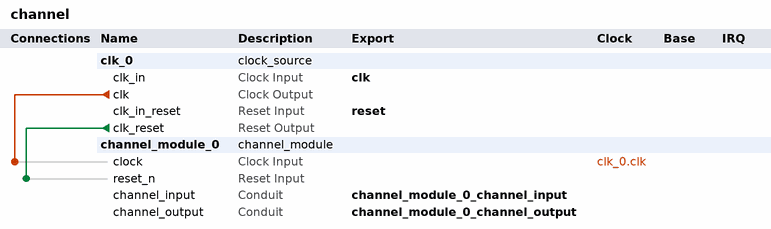
[diagram p0: system contents]
# Platform Designer (Qsys) system channel, Cyclone V 5CSEMA5F31C6
# Parameters at their usual value, and those the tool derives, are not listed.
package require -exact qsys 22.1
create_system channel
set_project_property DEVICE_FAMILY {Cyclone V}
set_project_property DEVICE 5CSEMA5F31C6

add_instance clk_0 clock_source 22.1
set_instance_parameter_value clk_0 clockFrequency 50000000

add_instance channel_module_0 channel_module 1.0
set_instance_parameter_value channel_module_0 PULSE_RESPONSE_LENGTH 2
set_instance_parameter_value channel_module_0 SIGNAL_RESOLUTION 8
set_instance_parameter_value channel_module_0 SYMBOL_SEPERATION 56

# connections
add_connection clk_0.clk channel_module_0.clock clock
add_connection clk_0.clk_reset channel_module_0.reset_n reset

# exported interfaces
add_interface channel_module_0_channel_input conduit end
set_interface_property channel_module_0_channel_input EXPORT_OF channel_module_0.channel_input
add_interface channel_module_0_channel_output conduit end
set_interface_property channel_module_0_channel_output EXPORT_OF channel_module_0.channel_output
add_interface clk clock sink
set_interface_property clk EXPORT_OF clk_0.clk_in
add_interface reset reset sink
set_interface_property reset EXPORT_OF clk_0.clk_in_reset

set_interconnect_requirement {$system} qsys_mm.clockCrossingAdapter HANDSHAKE
set_interconnect_requirement {$system} qsys_mm.enableEccProtection FALSE
set_interconnect_requirement {$system} qsys_mm.insertDefaultSlave FALSE
set_interconnect_requirement {$system} qsys_mm.maxAdditionalLatency 1

save_system channel.qsys
